# EAGLE design ProtoShieldU (EAGLE 5.10)
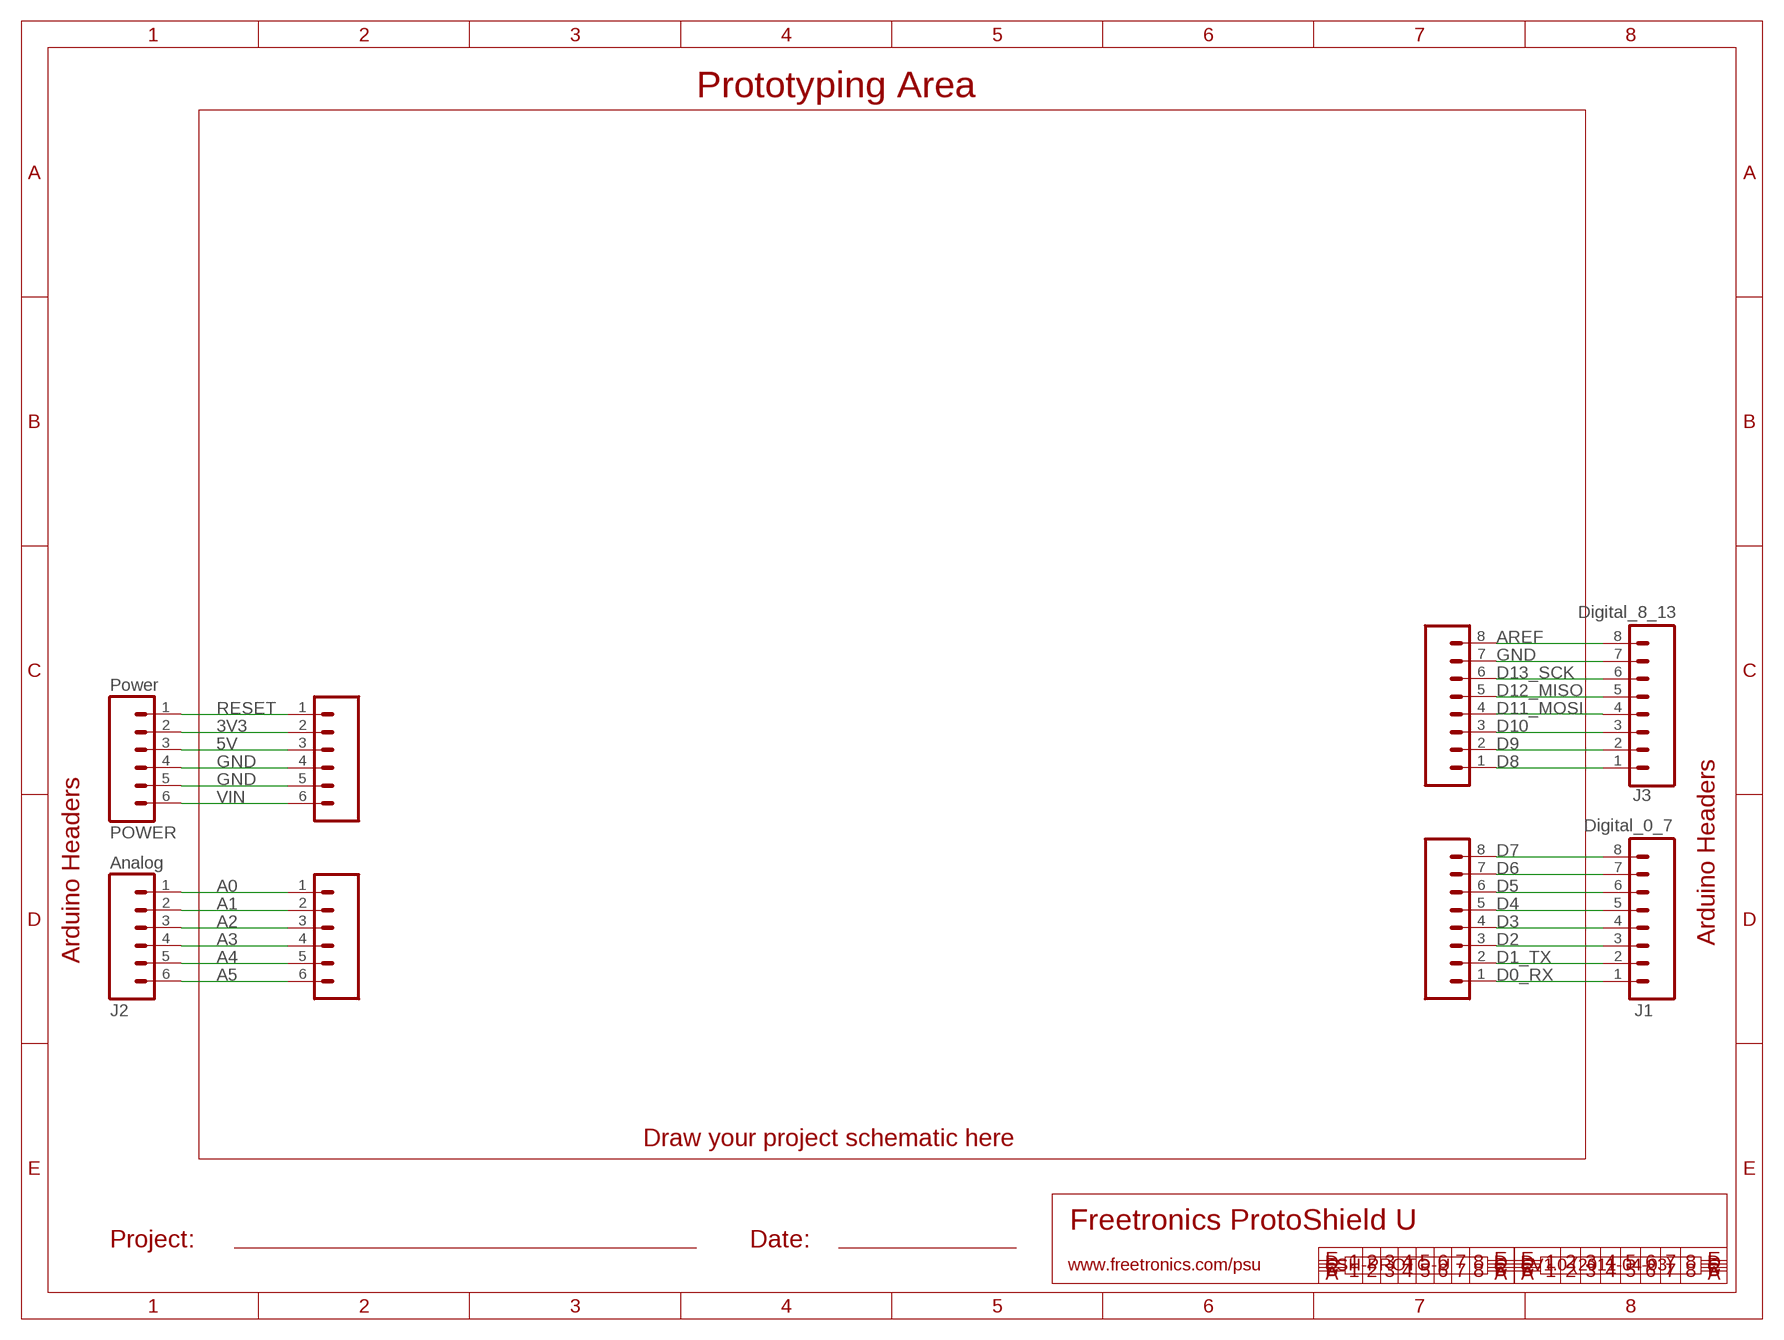
[diagram p0: schematic, sheet 1]

## Parts
J1  Digital_0_7  M08  [1X08]
J2  Analog  M06SIP  [1X06]
J3  Digital_8_13  M08  [1X08]
POWER  Power  M06SIP  [1X06]
SL1  Digital_0_7  M08  [1X08]
SL2  Analog  M06SIP  [1X06]
SL3  Digital_8_13  M08  [1X08]
SLP  Power  M06SIP  [1X06]

## Nets
3V3: POWER.2 SLP.2
5V: POWER.3 SLP.3
A0: J2.1 SL2.1
A1: J2.2 SL2.2
A2: J2.3 SL2.3
A3: J2.4 SL2.4
A4: J2.5 SL2.5
A5: J2.6 SL2.6
AREF: J3.8 SL3.8
D0_RX: J1.1 SL1.1
D1_TX: J1.2 SL1.2
D2: J1.3 SL1.3
D3: J1.4 SL1.4
D4: J1.5 SL1.5
D5: J1.6 SL1.6
D6: J1.7 SL1.7
D7: J1.8 SL1.8
D8: J3.1 SL3.1
D9: J3.2 SL3.2
D10: J3.3 SL3.3
D11_MOSI: J3.4 SL3.4
D12_MISO: J3.5 SL3.5
D13_SCK: J3.6 SL3.6
GND: J3.7 POWER.4 POWER.5 SL3.7 SLP.4 SLP.5
RESET: POWER.1 SLP.1
VIN: POWER.6 SLP.6

## Notes on the sheet
- Prototyping Area
- Arduino Headers
- Arduino Headers
- Draw your project schematic here
- Freetronics ProtoShield U
- Project: | Date:
- www.freetronics.com/psu | SH-PROTO-U | V1.0 (2011-04-03)

## Library data of the parts
J1 J3 SL1 SL3 = freetronics:M08: Header 8 Standard 8-pin 0.1" header. Use with straight break away headers (SKU : PRT-00116), right angle break away headers (PRT-00553), swiss pins (PRT-00743), machine pins (PRT-00117), and female headers (PRT-00115).
J2 POWER SL2 SLP = freetronics:M06: Header 6 Standard 6-pin 0.1" header. Use with straight break away headers (SKU : PRT-00116), right angle break away headers (PRT-00553), swiss pins (PRT-00743), machine pins (PRT-00117), and female headers (PRT-00115). Molex polarized connector foot print use with SKU : PRT-08094 with associated crimp pins and housings. NOTES ON THE VARIANTS LOCK and LOCK_LONGPADS... This footprint was designed to help hold the alignment of a through-hole component (i.e. 6-pin header) while soldering it into place. You may notice that each hole has been shifted either up or down by 0.005 of an inch from it's more standard position (which is a perfectly straight line). This slight alteration caused the pins (the squares in the middle) to touch the edges of the holes. Because they are alternating, it causes a "brace" to hold the component in place. 0.005 has proven to be the perfect amount of "off-center" position when using our standard breakaway headers. Although looks a little odd when you look at the bare footprint, once you have a header in there, the alteration is very hard to notice. Also, if you push a header all the way into place, it is covered up entirely on the bottom side. This idea of altering the position of holes to aid alignment will be further integrated into the Sparkfun Library for other footprints. It can help hold any component with 3 or more connection pins.

## Board
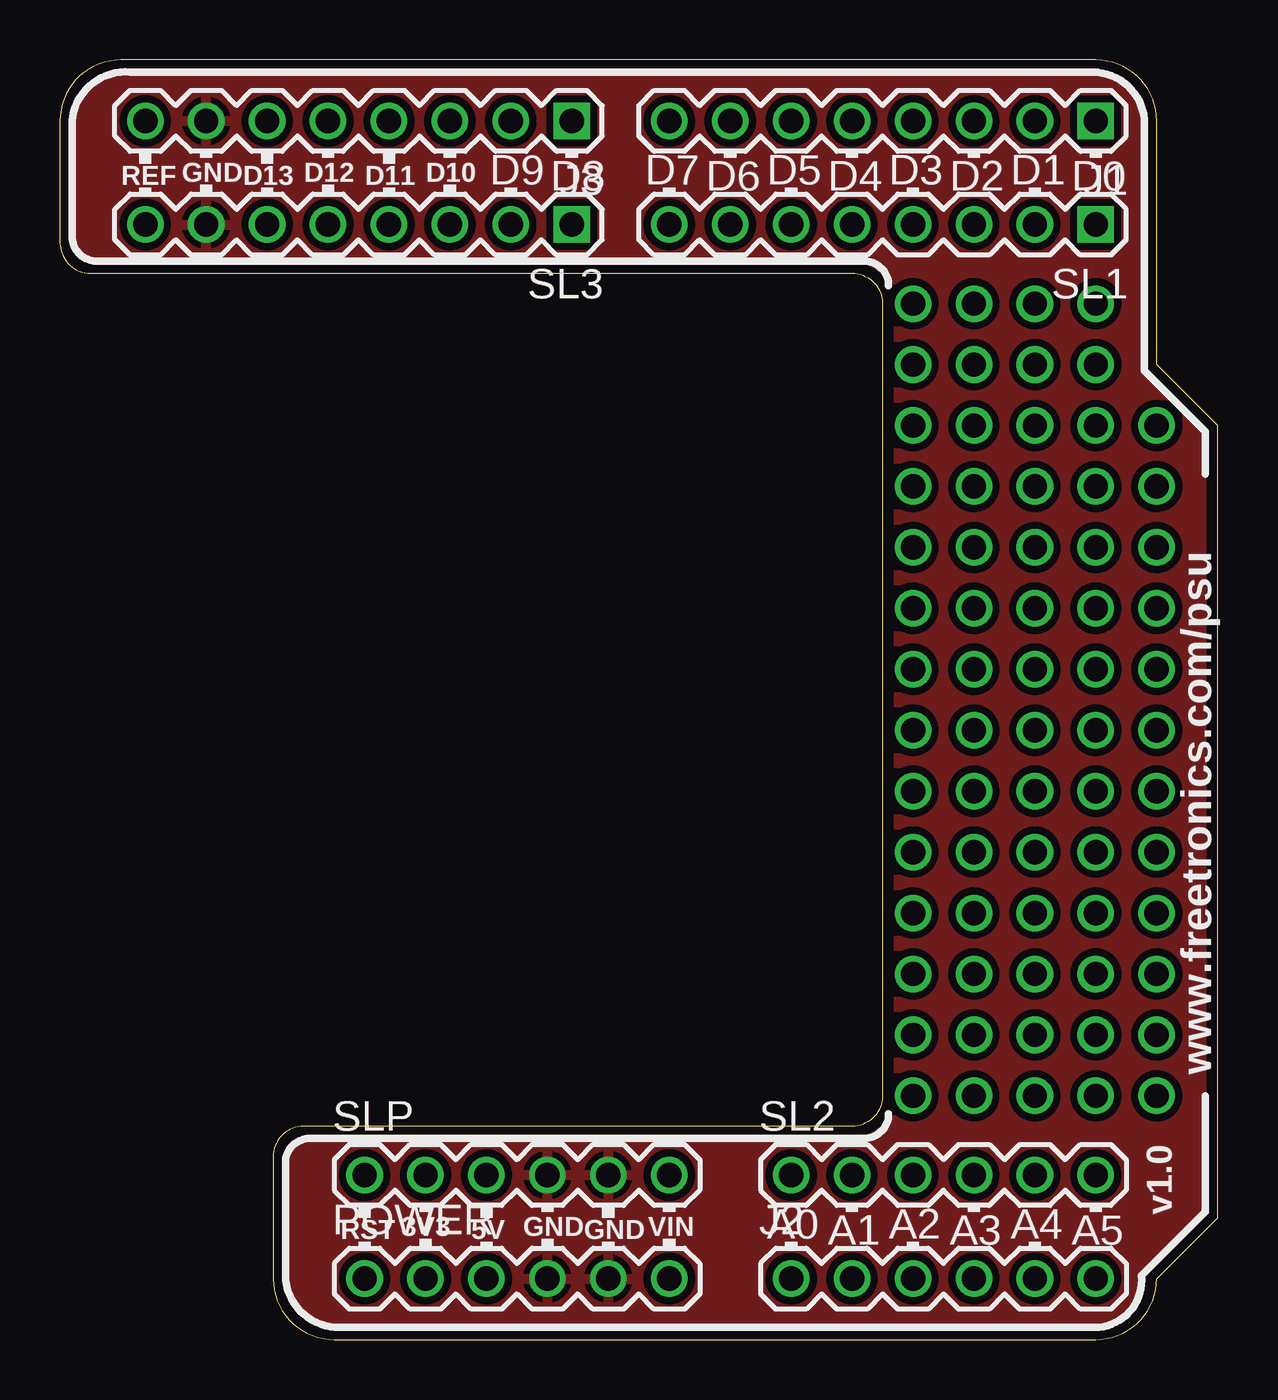
[diagram p1: board, top side]
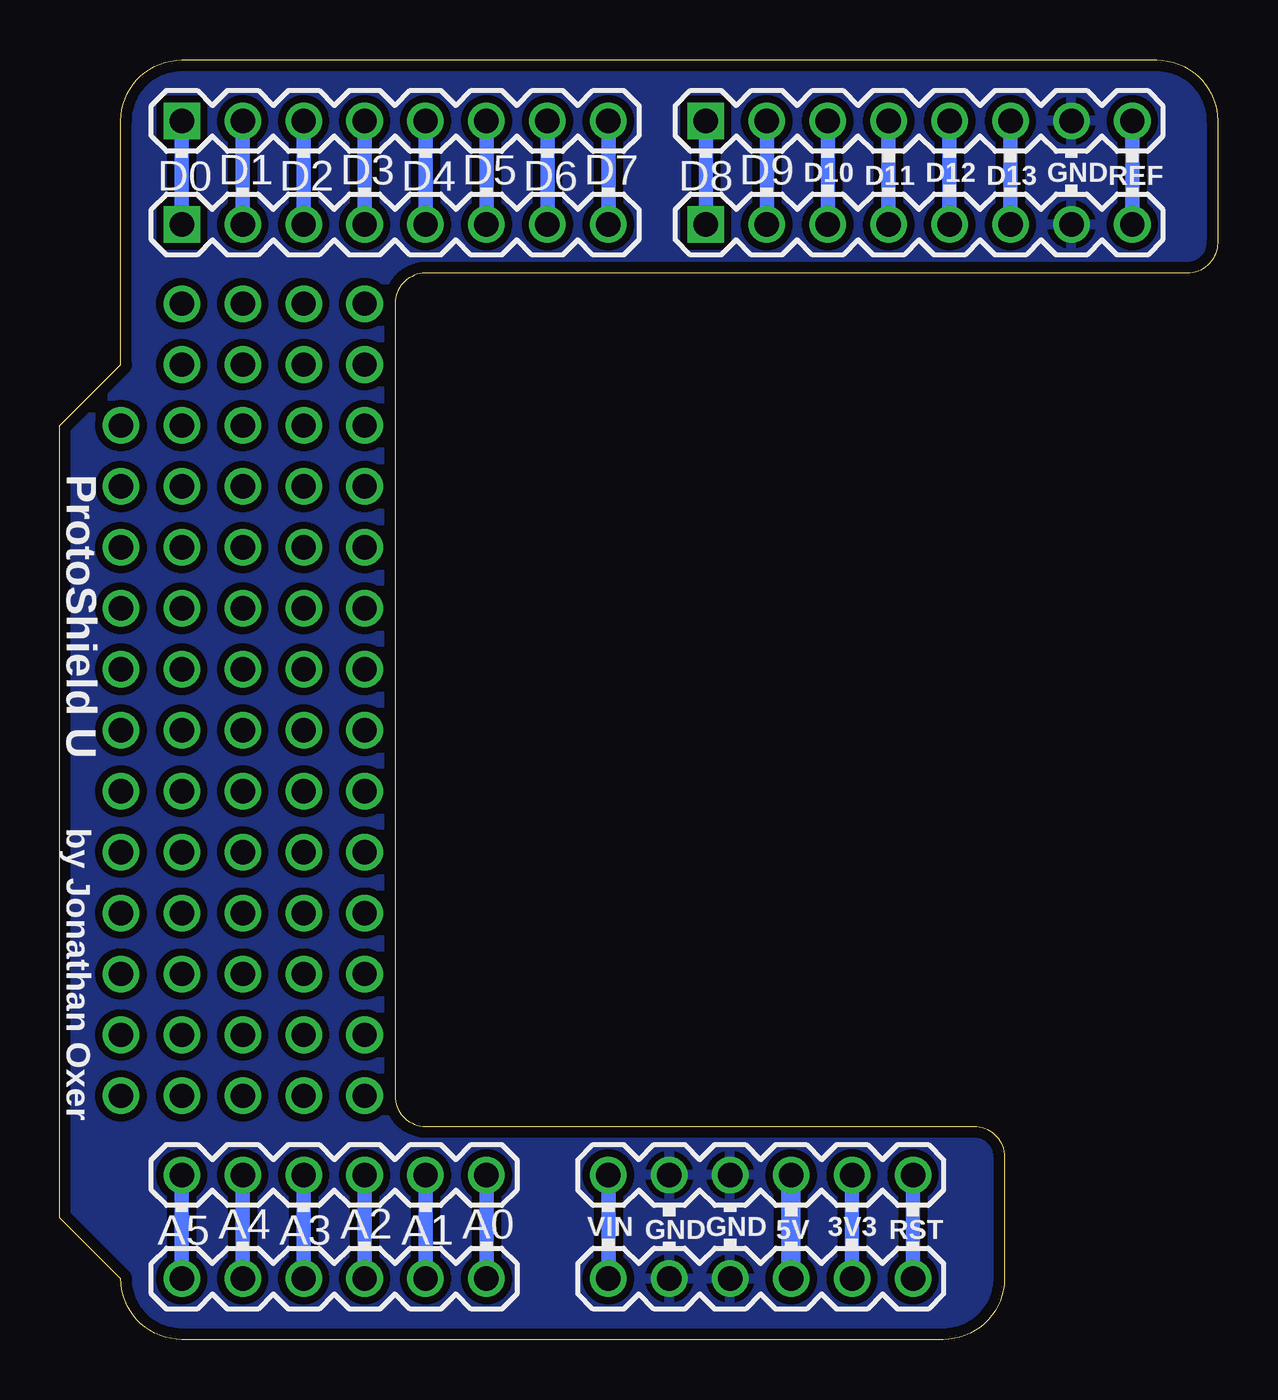
[diagram p2: board, bottom side, seen from below]

Size 48.26 x 53.34 mm. Coordinates in mm from the lower left corner, seen from the top.
Outline: 8.89,2.54 arc90 11.43,0 43.18,0 arc90 45.72,2.54 48.26,5.08 48.26,38.1 45.72,40.64 45.72,50.8 arc90 43.18,53.34 2.54,53.34 arc90 0,50.8 0,45.72 arc90 1.27,44.45 33.02,44.45 arc-90 34.29,43.18 34.29,10.16 arc-90 33.02,8.89 10.16,8.89 arc90 8.89,7.62 8.89,2.54
Copper layers (1*16): Top 0.035mm / dielectric 1.5mm / Bottom 0.035mm
Design rules "default *": minimum track width 10mil, minimum drill 24mil, track to track 12mil, track to pad 12mil, pad to pad 12mil, via to via 12mil, smd to smd 8mil, copper to edge 18mil, drill to drill 8mil, minimum pad ring 10mil, minimum via ring 8mil, stop-mask expansion 4mil, vias tented up to drill 0mil, thermal gap 10mil

### Footprints (pad centres in the part's own frame; a part is rotated, then mirrored left to right if it is on the bottom)
1X08 = drill 1.016 square: 1 0,0 | drill 1.016 round: 2 2.54,0; 3 5.08,0; 4 7.62,0; 5 10.16,0; 6 12.7,0; 7 15.24,0; 8 17.78,0
1X06 = drill 1.016 round: 1 0,0; 2 2.54,0; 3 5.08,0; 4 7.62,0; 5 10.16,0; 6 12.7,0

### Placement (x,y rotation side)
J1  43.18,50.8 180 top
J2  30.48,2.54 0 top
J3  21.34,50.8 180 top
POWER  12.7,2.54 0 top
SL1  43.18,46.48 180 top
SL2  30.48,6.86 0 top
SL3  21.34,46.48 180 top
SLP  12.7,6.86 0 top

### Tracks (layer width: path | path; a pad name or v marks a point on that pad's centre or on a via)
3V3
  Bottom 0.61: POWER.2 SLP.2
5V
  Bottom 0.813: POWER.3 SLP.3
A0
  Bottom 0.61: J2.1 SL2.1
A1
  Bottom 0.61: J2.2 SL2.2
A2
  Bottom 0.61: J2.3 SL2.3
A3
  Bottom 0.61: J2.4 SL2.4
A4
  Bottom 0.61: J2.5 SL2.5
A5
  Bottom 0.61: J2.6 SL2.6
AREF
  Bottom 0.61: SL3.8 J3.8
D0_RX
  Bottom 0.61: SL1.1 J1.1
D1_TX
  Bottom 0.61: SL1.2 J1.2
D2
  Bottom 0.61: SL1.3 J1.3
D3
  Bottom 0.61: SL1.4 J1.4
D4
  Bottom 0.61: SL1.5 J1.5
D5
  Bottom 0.61: SL1.6 J1.6
D6
  Bottom 0.61: SL1.7 J1.7
D7
  Bottom 0.61: SL1.8 J1.8
D8
  Bottom 0.61: SL3.1 J3.1
D9
  Bottom 0.61: SL3.2 J3.2
D10
  Bottom 0.61: SL3.3 J3.3
D11_MOSI
  Bottom 0.61: SL3.4 J3.4
D12_MISO
  Bottom 0.61: SL3.5 J3.5
D13_SCK
  Bottom 0.61: SL3.6 J3.6
GND
  pour Bottom: 0,50.8 arc-74 2.54,53.34 43.18,53.34 arc-74 45.72,50.8 45.72,40.64 48.26,38.1 48.26,5.08 45.72,2.54 arc-74 43.18,0 11.43,0 arc-74 8.89,2.54 8.89,7.62 arc-90 10.16,8.89 33.02,8.89 arc90 34.29,10.16 34.29,43.18 arc90 33.02,44.45 1.27,44.45 arc-90 0,45.72
  pour Top: 0,50.8 arc-74 2.54,53.34 43.18,53.34 arc-74 45.72,50.8 45.72,40.64 48.26,38.1 48.26,5.08 45.72,2.54 arc-74 43.18,0 11.43,0 arc-74 8.89,2.54 8.89,7.62 arc-90 10.16,8.89 33.02,8.89 arc90 34.29,10.16 34.29,43.18 arc90 33.02,44.45 1.27,44.45 arc-90 0,45.72
N$1  (via drill 1.02)
  other vias: 43.18,10.16
N$2  (via drill 1.02)
  other vias: 40.64,10.16
N$3  (via drill 1.02)
  other vias: 38.1,10.16
N$4  (via drill 1.02)
  other vias: 35.56,10.16
N$5  (via drill 1.02)
  other vias: 38.1,15.24
N$6  (via drill 1.02)
  other vias: 43.18,40.64
N$7  (via drill 1.02)
  other vias: 35.56,15.24
N$8  (via drill 1.02)
  other vias: 43.18,12.7
N$9  (via drill 1.02)
  other vias: 43.18,43.18
N$10  (via drill 1.02)
  other vias: 45.72,12.7
N$11  (via drill 1.02)
  other vias: 45.72,15.24
N$12  (via drill 1.02)
  other vias: 45.72,17.78
N$13  (via drill 1.02)
  other vias: 45.72,20.32
N$14  (via drill 1.02)
  other vias: 45.72,22.86
N$15  (via drill 1.02)
  other vias: 45.72,25.4
N$16  (via drill 1.02)
  other vias: 45.72,27.94
N$17  (via drill 1.02)
  other vias: 45.72,30.48
N$18  (via drill 1.02)
  other vias: 45.72,33.02
N$19  (via drill 1.02)
  other vias: 45.72,35.56
N$20  (via drill 1.02)
  other vias: 45.72,38.1
N$21  (via drill 1.02)
  other vias: 45.72,10.16
N$22  (via drill 1.02)
  other vias: 38.1,17.78
N$23  (via drill 1.02)
  other vias: 35.56,17.78
N$24  (via drill 1.02)
  other vias: 40.64,12.7
N$38  (via drill 1.02)
  other vias: 38.1,20.32
N$39  (via drill 1.02)
  other vias: 35.56,20.32
N$40  (via drill 1.02)
  other vias: 38.1,12.7
N$54  (via drill 1.02)
  other vias: 38.1,22.86
N$55  (via drill 1.02)
  other vias: 35.56,22.86
N$56  (via drill 1.02)
  other vias: 35.56,12.7
N$70  (via drill 1.02)
  other vias: 38.1,25.4
N$71  (via drill 1.02)
  other vias: 35.56,25.4
N$86  (via drill 1.02)
  other vias: 38.1,27.94
N$87  (via drill 1.02)
  other vias: 35.56,27.94
N$102  (via drill 1.02)
  other vias: 38.1,30.48
N$103  (via drill 1.02)
  other vias: 35.56,30.48
N$118  (via drill 1.02)
  other vias: 38.1,33.02
N$119  (via drill 1.02)
  other vias: 35.56,33.02
N$134  (via drill 1.02)
  other vias: 38.1,35.56
N$135  (via drill 1.02)
  other vias: 35.56,35.56
N$136  (via drill 1.02)
  other vias: 40.64,43.18
N$150  (via drill 1.02)
  other vias: 38.1,38.1
N$151  (via drill 1.02)
  other vias: 35.56,38.1
N$152  (via drill 1.02)
  other vias: 38.1,43.18
N$166  (via drill 1.02)
  other vias: 38.1,40.64
N$167  (via drill 1.02)
  other vias: 35.56,40.64
N$168  (via drill 1.02)
  other vias: 35.56,43.18
N$182  (via drill 1.02)
  other vias: 40.64,15.24
N$183  (via drill 1.02)
  other vias: 40.64,17.78
N$184  (via drill 1.02)
  other vias: 40.64,20.32
N$185  (via drill 1.02)
  other vias: 40.64,22.86
N$186  (via drill 1.02)
  other vias: 40.64,25.4
N$187  (via drill 1.02)
  other vias: 40.64,27.94
N$188  (via drill 1.02)
  other vias: 40.64,30.48
N$189  (via drill 1.02)
  other vias: 40.64,33.02
N$190  (via drill 1.02)
  other vias: 40.64,35.56
N$191  (via drill 1.02)
  other vias: 40.64,38.1
N$193  (via drill 1.02)
  other vias: 43.18,15.24
N$194  (via drill 1.02)
  other vias: 43.18,17.78
N$195  (via drill 1.02)
  other vias: 43.18,20.32
N$196  (via drill 1.02)
  other vias: 43.18,22.86
N$197  (via drill 1.02)
  other vias: 43.18,25.4
N$198  (via drill 1.02)
  other vias: 43.18,27.94
N$199  (via drill 1.02)
  other vias: 43.18,30.48
N$200  (via drill 1.02)
  other vias: 43.18,33.02
N$201  (via drill 1.02)
  other vias: 43.18,35.56
N$202  (via drill 1.02)
  other vias: 43.18,38.1
N$203  (via drill 1.02)
  other vias: 40.64,40.64
RESET
  Bottom 0.61: POWER.1 SLP.1
VIN
  Bottom 0.61: POWER.6 SLP.6

### Text on the board
tPlace: REF | GND | D13 | D12 | D11 | D10 | D9 | D8 | D7 | D6 | D5 | D4 | D3 | D2 | D1 | D0 | www.freetronics.com/psu | v1.0 | RST | 3V3 | 5V | GND | GND | VIN | A0 | A1 | A2 | A3 | A4 | A5
bPlace: REF | GND | D13 | D12 | D11 | D10 | D9 | D8 | D7 | D6 | D5 | D4 | D3 | D2 | D1 | D0 | ProtoShield U | by Jonathan Oxer | RST | 3V3 | 5V | GND | GND | VIN | A0 | A1 | A2 | A3 | A4 | A5